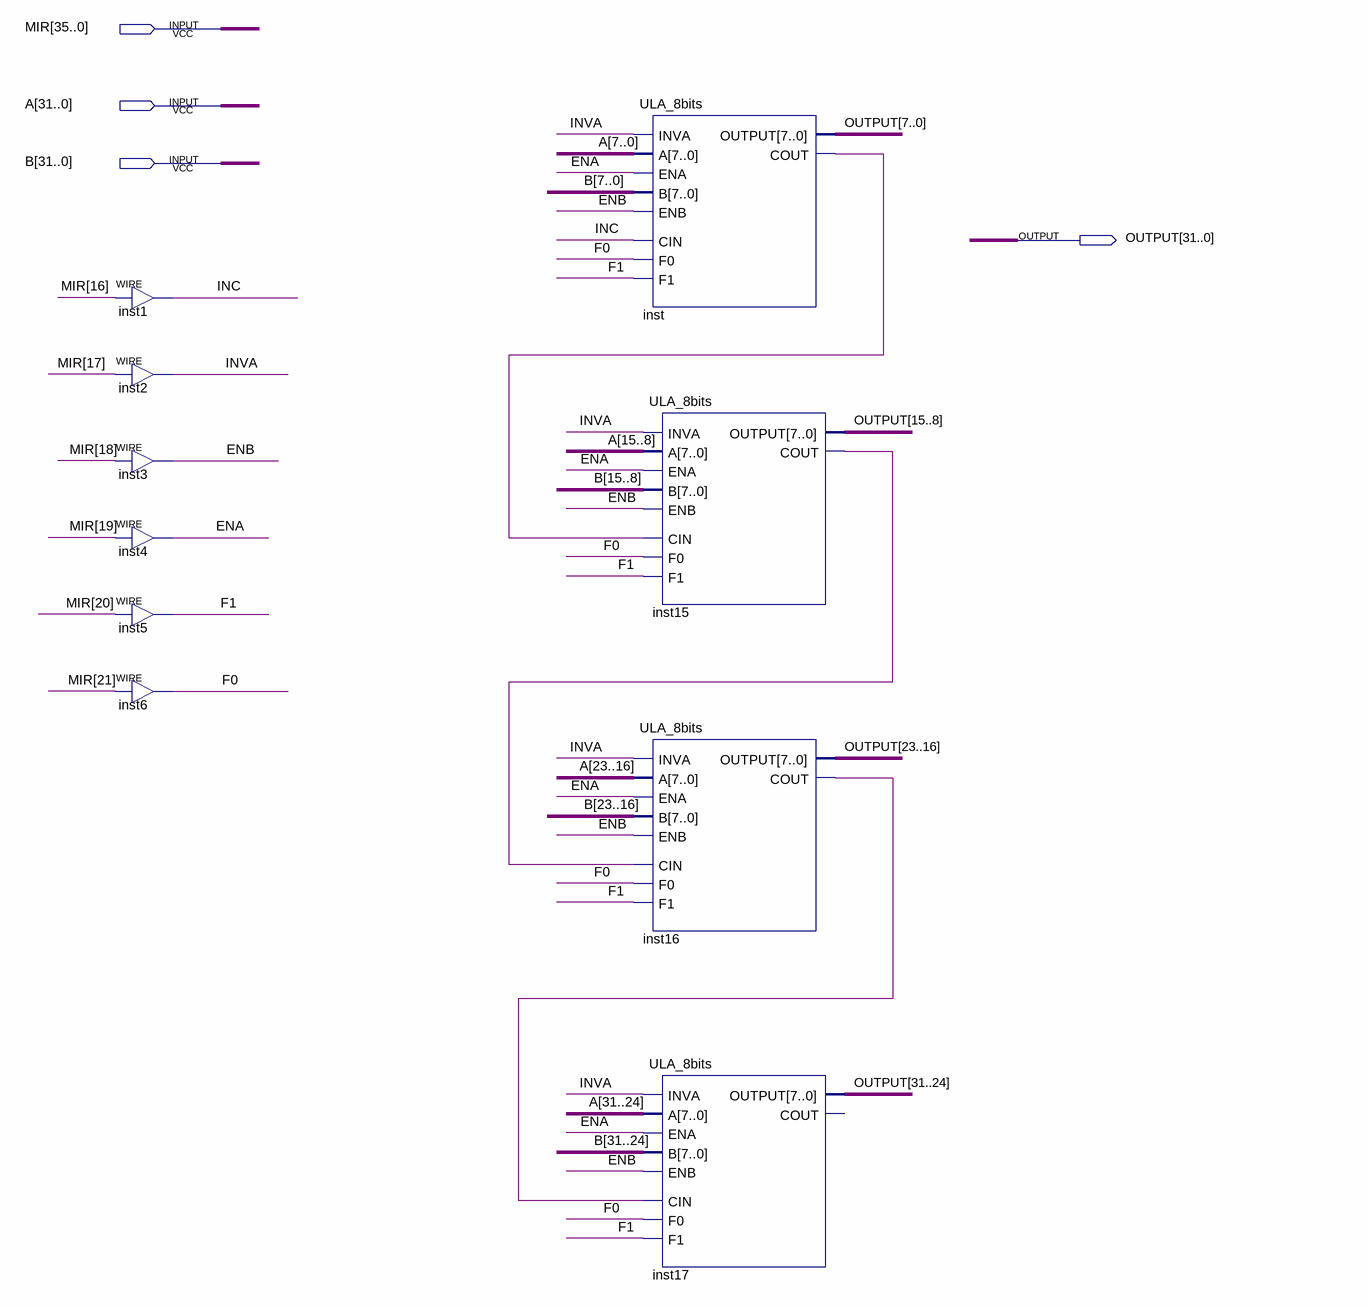
[diagram p0: schematic sheet]
// Quartus schematic ULA_32bits.bdf as structural Verilog: 10 symbols, 4 pins
module ULA_32bits (
  input  [35:0] MIR,
  input  [31:0] A,
  input  [31:0] B,
  output [31:0] OUTPUT
);

  wire ENA, ENB, F0, F1, INC, inst15_cout, inst16_cout, inst_cout, INVA;

  assign INC = MIR[16];  // WIRE inst1
  assign INVA = MIR[17];  // WIRE inst2
  assign ENB = MIR[18];  // WIRE inst3
  assign ENA = MIR[19];  // WIRE inst4
  assign F1 = MIR[20];  // WIRE inst5
  assign F0 = MIR[21];  // WIRE inst6
  ULA_8bits inst (
    .INVA(INVA), .A(A[7:0]), .ENA(ENA), .B(B[7:0]), .ENB(ENB), .F0(F0), .F1(F1), .CIN(INC),
    .OUTPUT(OUTPUT[7:0]), .COUT(inst_cout));
  ULA_8bits inst15 (
    .INVA(INVA), .A(A[15:8]), .ENA(ENA), .B(B[15:8]), .ENB(ENB), .F0(F0), .F1(F1), .CIN(inst_cout),
    .OUTPUT(OUTPUT[15:8]), .COUT(inst15_cout));
  ULA_8bits inst16 (
    .INVA(INVA), .A(A[23:16]), .ENA(ENA), .B(B[23:16]), .ENB(ENB), .F0(F0), .F1(F1), .CIN(inst15_cout),
    .OUTPUT(OUTPUT[23:16]), .COUT(inst16_cout));
  ULA_8bits inst17 (
    .INVA(INVA), .A(A[31:24]), .ENA(ENA), .B(B[31:24]), .ENB(ENB), .F0(F0), .F1(F1), .CIN(inst16_cout),
    .OUTPUT(OUTPUT[31:24]));  // open: COUT
endmodule
